# Altium schematic sheet mipi_to_lvds.SchDoc
size A4
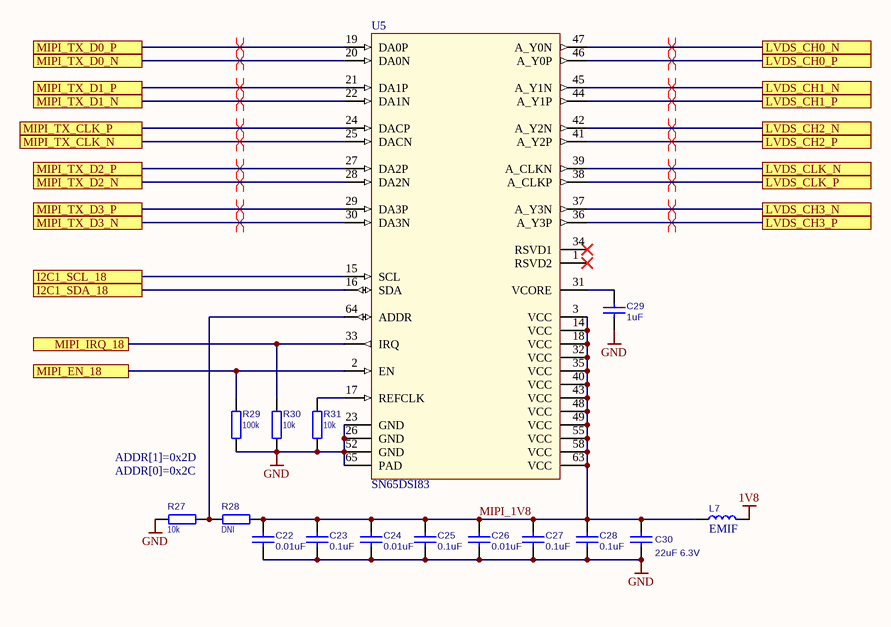
[diagram p0: mipi_to_lvds.SchDoc]

## Parts
C22  value 0.01uF  [C0603]  (hidden comment: CL10B103KB8NNNC)
C23  value 0.1uF  [C0603]  (hidden comment: C1608X7R1H104K080AA)
C24  value 0.01uF  [C0603]  (hidden comment: CL10B103KB8NNNC)
C25  value 0.1uF  [C0603]  (hidden comment: C1608X7R1H104K080AA)
C26  value 0.01uF  [C0603]  (hidden comment: CL10B103KB8NNNC)
C27  value 0.1uF  [C0603]  (hidden comment: C1608X7R1H104K080AA)
C28  value 0.1uF  [C0603]  (hidden comment: C1608X7R1H104K080AA)
C29  value 1uF  [C0603]  (hidden comment: CL21B105KAFNNNE)
C30  value 22uF 6.3V  [C0805]  (hidden comment: CL21A226MQQNNNE)
L7  value EMIF  [IND0805]  (hidden comment: BLM21PG221SN1D)
R27  10k  [R0603]
R28  DNI  [R0603]
R29  value 100k  [R0603]  (hidden comment: 10k)
R30  10k  [R0603]
R31  10k  [R0603]
U5  SN65DSI83  [HPM064_N]

## Ports
I2C1_SCL_18, I2C1_SDA_18, LVDS_CH0_N, LVDS_CH0_P, LVDS_CH1_N, LVDS_CH1_P, LVDS_CH2_N, LVDS_CH2_P, LVDS_CH3_N, LVDS_CH3_P, LVDS_CLK_N, LVDS_CLK_P, MIPI_EN_18, MIPI_IRQ_18, MIPI_TX_CLK_N, MIPI_TX_CLK_P, MIPI_TX_D0_N, MIPI_TX_D0_P, MIPI_TX_D1_N, MIPI_TX_D1_P, MIPI_TX_D2_N, MIPI_TX_D2_P, MIPI_TX_D3_N, MIPI_TX_D3_P

## Nets
1V8: L7.2
GND: C22.2 C23.1 C24.2 C25.1 C26.2 C27.1 C28.1 C29.1 C30.1 R27.1 R29.1 R30.1 R31.1 U5.23(GND) U5.26(GND) U5.52(GND) U5.65(PAD)
I2C1_SCL_18: U5.15(SCL) ; port I2C1_SCL_18
I2C1_SDA_18: U5.16(SDA) ; port I2C1_SDA_18
LVDS_CH0_N: U5.47(A_Y0N) ; port LVDS_CH0_N
LVDS_CH0_P: U5.46(A_Y0P) ; port LVDS_CH0_P
LVDS_CH1_N: U5.45(A_Y1N) ; port LVDS_CH1_N
LVDS_CH1_P: U5.44(A_Y1P) ; port LVDS_CH1_P
LVDS_CH2_N: U5.42(A_Y2N) ; port LVDS_CH2_N
LVDS_CH2_P: U5.41(A_Y2P) ; port LVDS_CH2_P
LVDS_CH3_N: U5.37(A_Y3N) ; port LVDS_CH3_N
LVDS_CH3_P: U5.36(A_Y3P) ; port LVDS_CH3_P
LVDS_CLK_N: U5.39(A_CLKN) ; port LVDS_CLK_N
LVDS_CLK_P: U5.38(A_CLKP) ; port LVDS_CLK_P
MIPI_1V8: C22.1 C23.2 C24.1 C25.2 C26.1 C27.2 C28.2 C30.2 L7.1 R28.2 U5.3(VCC) U5.14(VCC) U5.18(VCC) U5.32(VCC) U5.35(VCC) U5.40(VCC) U5.43(VCC) U5.48(VCC) U5.49(VCC) U5.55(VCC) U5.58(VCC) U5.63(VCC)
MIPI_EN_18: R29.2 U5.2(EN) ; port MIPI_EN_18
MIPI_IRQ_18: R30.2 U5.33(IRQ) ; port MIPI_IRQ_18
MIPI_TX_CLK_N: U5.25(DACN) ; port MIPI_TX_CLK_N
MIPI_TX_CLK_P: U5.24(DACP) ; port MIPI_TX_CLK_P
MIPI_TX_D0_N: U5.20(DA0N) ; port MIPI_TX_D0_N
MIPI_TX_D0_P: U5.19(DA0P) ; port MIPI_TX_D0_P
MIPI_TX_D1_N: U5.22(DA1N) ; port MIPI_TX_D1_N
MIPI_TX_D1_P: U5.21(DA1P) ; port MIPI_TX_D1_P
MIPI_TX_D2_N: U5.28(DA2N) ; port MIPI_TX_D2_N
MIPI_TX_D2_P: U5.27(DA2P) ; port MIPI_TX_D2_P
MIPI_TX_D3_N: U5.30(DA3N) ; port MIPI_TX_D3_N
MIPI_TX_D3_P: U5.29(DA3P) ; port MIPI_TX_D3_P
NetC29_2: C29.2 U5.31(VCORE)
NetR27_2: R27.2 R28.1 U5.64(ADDR)
NetR31_2: R31.2 U5.17(REFCLK)

Not connected (* = marked no-connect by the designer): U5 1(RSVD2)* 34(RSVD1)*

## Layout directives
differential pair: LVDS_CH0_N, LVDS_CH0_P, LVDS_CH1_N, LVDS_CH1_P, LVDS_CH2_N, LVDS_CH2_P, LVDS_CH3_N, LVDS_CH3_P, LVDS_CLK_N, LVDS_CLK_P, MIPI_TX_CLK_N, MIPI_TX_CLK_P, MIPI_TX_D0_N, MIPI_TX_D0_P, MIPI_TX_D1_N, MIPI_TX_D1_P, MIPI_TX_D2_N, MIPI_TX_D2_P, MIPI_TX_D3_N, MIPI_TX_D3_P

## Notes on the sheet
- ADDR[1]=0x2D
- ADDR[0]=0x2C

## Library data of the parts
C22-C30 = CAP_NPOL
L7 = IND_WO_IRON
R27-R31 = RESISTOR: RES
  R27 R30 R31: Value: 10k
  R28: Value: DNI
U5 = SN65DSI83: Single-Channel MIPI® DSI to Single-Link LVDS Bridge; value: SN65DSI83